# EAGLE schematic pressure_recorder (EAGLE 6.5.0)
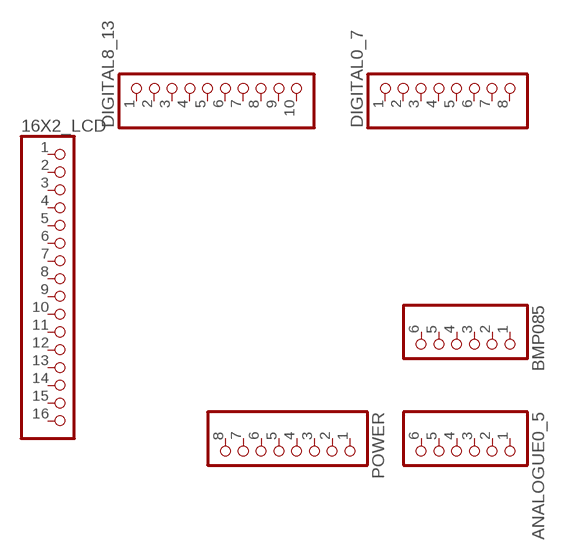
[diagram p0: schematic, sheet 1]

## Parts
16X2_LCD  PINHD-1X16  [1X16]
ANALOGUE0_5  PINHD-1X6  [1X06]
BMP085  PINHD-1X6  [1X06]
DIGITAL0_7  PINHD-1X8  [1X08]
DIGITAL8_13  PINHD-1X10  [1X10]
POWER  PINHD-1X8  [1X08]
Unconnected: 16X2_LCD.1 16X2_LCD.2 16X2_LCD.3 16X2_LCD.4 16X2_LCD.5 16X2_LCD.6 16X2_LCD.7 16X2_LCD.8 16X2_LCD.9 16X2_LCD.10 16X2_LCD.11 16X2_LCD.12 16X2_LCD.13 16X2_LCD.14 16X2_LCD.15 16X2_LCD.16 ANALOGUE0_5.1 ANALOGUE0_5.2 ANALOGUE0_5.3 ANALOGUE0_5.4 ANALOGUE0_5.5 ANALOGUE0_5.6 BMP085.1 BMP085.2 BMP085.3 BMP085.4 BMP085.5 BMP085.6 DIGITAL0_7.1 DIGITAL0_7.2 DIGITAL0_7.3 DIGITAL0_7.4 DIGITAL0_7.5 DIGITAL0_7.6 DIGITAL0_7.7 DIGITAL0_7.8 DIGITAL8_13.1 DIGITAL8_13.2 DIGITAL8_13.3 DIGITAL8_13.4 DIGITAL8_13.5 DIGITAL8_13.6 DIGITAL8_13.7 DIGITAL8_13.8 DIGITAL8_13.9 DIGITAL8_13.10 POWER.1 POWER.2 POWER.3 POWER.4 POWER.5 POWER.6 POWER.7 POWER.8

## Library data of the parts
16X2_LCD = pinhead:PINHD-1X16: PIN HEADER
ANALOGUE0_5 BMP085 = pinhead:PINHD-1X6: PIN HEADER
DIGITAL0_7 POWER = pinhead:PINHD-1X8: PIN HEADER
DIGITAL8_13 = pinhead:PINHD-1X10: PIN HEADER